# Altium schematic sheet ESp32.SchDoc
size A4
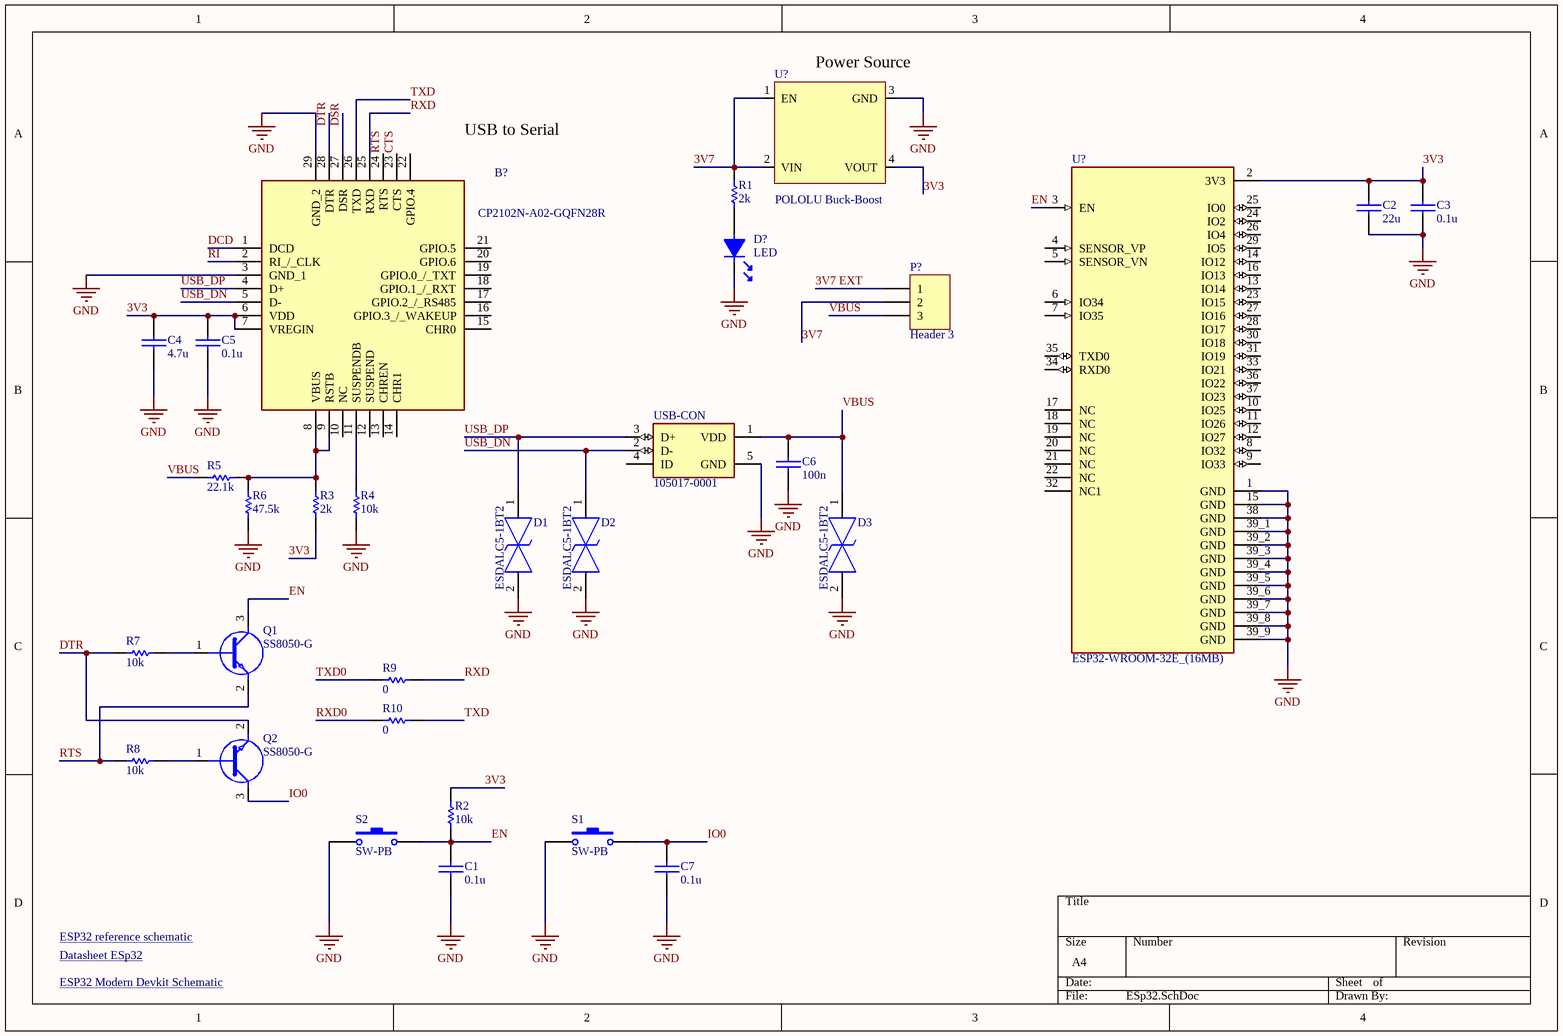
[diagram p0: ESp32.SchDoc]

## Parts
(Parts that share a designator on the sheet are numbered #1, #2 ... from top to bottom, then left to right.)
B?  CP2102N-A02-GQFN28R  [QFN50P500X500X80-29N-D]
C1  0.1u  [CAPSMD0805]
C2  22u  [CAPSMD0805]
C3  0.1u  [CAPSMD0805]
C4  4.7u  [CAPSMD0805]
C5  0.1u  [CAPSMD0805]
C6  100n  [CAPSMD0805]
C7  0.1u  [CAPSMD0805]
D1  ESDALC5-1BT2  [ESDALC51BT2]
D2  ESDALC5-1BT2  [ESDALC51BT2]
D3  ESDALC5-1BT2  [ESDALC51BT2]
D?  LED  [LEDSMD0603]
P?  Header 3  [HDR1X3]
Q1  SS8050-G  [SOT95P240X115-3N]
Q2  SS8050-G  [SOT95P240X115-3N]
R1  2k  [RESSMD0805]
R2  10k  [RESSMD0805]
R3  2k  [RESSMD0805]
R4  10k  [RESSMD0805]
R5  22.1k  [RESSMD0805]
R6  47.5k  [RESSMD0805]
R7  10k  [RESSMD0805]
R8  10k  [RESSMD0805]
R9  0  [RESSMD0805]
R10  0  [RESSMD0805]
S1  SW-PB  [SW4SMD-4.2X3.2X2.5MM]
S2  SW-PB  [SW4SMD-4.2X3.2X2.5MM]
U?#1  POLOLU Buck-Boost
U?#2  ESP32-WROOM-32E_(16MB)  [XCVR_ESP32-WROOM-32E_(16MB)]
USB-CON  105017-0001  [MOLEX_105017-0001]

## Nets
GND: B?.3(GND_1) B?.29(GND_2) C1.2 C2.2 C3.2 C4.2 C5.2 C6.2 C7.2 D1.2 D2.2 D3.2 D?.K R4.1 R6.1 S1.1 S2.1 U?#1.3(GND) U?#2.1(GND) U?#2.15(GND) U?#2.38(GND) U?#2.39_1(GND) U?#2.39_2(GND) U?#2.39_3(GND) U?#2.39_4(GND) U?#2.39_5(GND) U?#2.39_6(GND) U?#2.39_7(GND) U?#2.39_8(GND) U?#2.39_9(GND) USB-CON.5(GND)
3V3: B?.6(VDD) B?.7(VREGIN) C2.1 C3.1 C4.1 C5.1 R2.2 R3.1 U?#1.4(VOUT) U?#2.2(3V3)
3V7: P?.2 R1.2 U?#1.1(EN) U?#1.2(VIN)
3V7 EXT: P?.1
CTS: B?.23(CTS)
DCD: B?.1(DCD)
DSR: B?.27(DSR)
DTR: B?.28(DTR) Q2.2(E) R7.2
EN: C1.1 Q1.3(C) R2.1 S2.2 U?#2.3(EN)
IO0: C7.1 Q2.3(C) S1.2
RI: B?.2(RI_/_CLK)
RTS: B?.24(RTS) Q1.2(E) R8.2
RXD: B?.25(RXD) R9.1
RXD0: R10.2
TXD: B?.26(TXD) R10.1
TXD0: R9.2
USB_DN: B?.5(D-) D2.1 USB-CON.2(D-)
USB_DP: B?.4(D+) D1.1 USB-CON.3(D+)
VBUS: C6.1 D3.1 P?.3 R5.2 USB-CON.1(VDD)
NetB?_8: B?.8(VBUS) B?.9(RSTB) R3.2 R5.1 R6.2
NetB?_11: B?.11(SUSPENDB) R4.2
NetD?_A: D?.A R1.1
NetQ1_1: Q1.1(B) R7.1
NetQ2_1: Q2.1(B) R8.1

Not connected (* = marked no-connect by the designer): B? 10(NC) 12(SUSPEND) 13(CHREN) 14(CHR1) 15(CHR0) 16(GPIO.3_/_WAKEUP) 17(GPIO.2_/_RS485) 18(GPIO.1_/_RXT) 19(GPIO.0_/_TXT) 20(GPIO.6) 21(GPIO.5) 22(GPIO.4); U?#2 4(SENSOR_VP) 5(SENSOR_VN) 6(IO34) 7(IO35) 8(IO32) 9(IO33) 10(IO25) 11(IO26) 12(IO27) 13(IO14) 14(IO12) 16(IO13) 17(NC) 18(NC) 19(NC) 20(NC) 21(NC) 22(NC) 23(IO15) 24(IO2) 25(IO0) 26(IO4) 27(IO16) 28(IO17) 29(IO5) 30(IO18) 31(IO19) 32(NC1) 33(IO21) 34(RXD0) 35(TXD0) 36(IO22) 37(IO23); USB-CON 4(ID)

## Notes on the sheet
- (near U?#1) Power Source
- (near B?) USB to Serial
- Datasheet ESp32 <https://www.espressif.com/sites/default/files/documentation/esp32-wroom-32e_esp32-wroom-32ue_datasheet_en.pdf>
- ESP32 Modern Devkit Schematic <https://dl.espressif.com/dl/schematics/ESP32-S2-DevKitM-1_V1_Schematics.pdf>
- ESP32 reference schematic <https://dl.espressif.com/dl/schematics/esp32_devkitc_v4-sch.pdf>

## Library data of the parts
B? = CP2102N-A02-GQFN28R: USB Interface IC USB to UART bridge - QFN28; Manufacturer_Name: Silicon Labs; Geometry.Height: 0.8mm; Mouser Part Number: 634-CP2102NA02QFN28R; Mouser Price/Stock: https://www.mouser.co.uk/ProductDetail/Silicon-Labs/CP2102N-A02-GQFN28R?qs=u16ybLDytRag4qKvSH3fTw%3D%3D; Manufacturer_Part_Number: CP2102N-A02-GQFN28R; Datasheet Link: https://www.silabs.com/documents/public/data-sheets/cp2102n-datasheet.pdf
C1 C4-C7 = CAP: Capacitor SMD
C2 C3 = CAP: Capacitor SMD 4.7nF
D1-D3 = ESDALC5-1BT2: ESD Suppressors / TVS Diodes Single Line Transil Vbr 5V min 26pF 0; Manufacturer_Name: STMicroelectronics; Mouser Part Number: 511-ESDALC5-1BT2; Mouser Price/Stock: https://www.mouser.co.uk/ProductDetail/STMicroelectronics/ESDALC5-1BT2?qs=z0iXaKah%2FHDPGBBIoqx%252BQw%3D%3D; Manufacturer_Part_Number: ESDALC5-1BT2; Datasheet Link: http://www.st.com/web/en/resource/technical/document/datasheet/CD00260064.pdf
D? = LED: LED SMD Verde
P? = Header 3: Header, 3-Pin; LatestRevisionDate: 17-Jul-2002; LatestRevisionNote: Re-released for DXP Platform.; Publisher: Altium Limited
Q1 Q2 = SS8050-G: Bipolar Transistors - BJT NPN TRANSISTOR 1.5A 40V; Manufacturer_Name: Comchip Technology; Geometry.Height: 1.15mm; Mouser Part Number: 750-SS8050-G; Mouser Price/Stock: https://www.mouser.co.uk/ProductDetail/Comchip-Technology/SS8050-G?qs=LLUE9lz1YbcHg%252BWLMAtcrQ%3D%3D; Manufacturer_Part_Number: SS8050-G; Datasheet Link: https://datasheet.datasheetarchive.com/originals/distributors/DKDS-12/229454.pdf
R1 R3 = RES: Resistencia SMD 2kohms
R2 = RES: Resistencia SMD 470ohms
R4 R7 R8 = RES: Resistencia SMD 10kohms
R5 = RES: Resistencia SMD 22.1kohms
R6 = RES: Resistencia SMD 47.5kohms
R9 R10 = RES: Resistencia SMD 0ohms
S1 S2 = SW-PB: Switch; Manufacturer Part Number: N/A
U?#1 = POLOLU Buck-Boost: Pololu S7V8F3 Buc-Boost regulator
U?#2 = ESP32-WROOM-32E_(16MB): Bluetooth, WiFi 802.11b/g/n, Bluetooth v4.2 +EDR, Class 1, 2 and 3 Transceiver Module 2.4GHz ~ 2.5GHz Integrated, Trace Surface Mount; MP: ESP32-WROOM-32E (16MB); MF: Espressif Systems; Price: None; Availability: Not in stock; Package: None; Value: *; SnapEDA_Link: https://www.snapeda.com/parts/ESP32-WROOM-32E%20(16MB)/Espressif+Systems/view-part/?ref=snap; Check_prices: https://www.snapeda.com/parts/ESP32-WROOM-32E%20(16MB)/Espressif+Systems/view-part/?ref=eda
USB-CON = 105017-0001: USB - micro B USB 2.0 Receptacle Connector 5 Position Surface Mount, Right Angle; Through Hole; MF: Molex; SnapEDA_Link: https://www.snapeda.com/parts/105017-0001/Molex/view-part/?ref=snap; Package: None; MP: 105017-0001; Check_prices: https://www.snapeda.com/parts/105017-0001/Molex/view-part/?ref=eda; Purchase-URL: https://pricing.snapeda.com/search/part/105017-0001/?ref=eda; Price: None; Value: *; Availability: In Stock